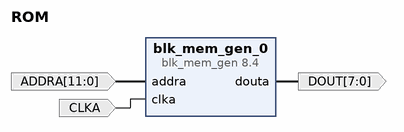
[diagram p0: block diagram of the top level]
# Vivado block design ROM, xc7z010clg400-1, Vivado 2022.2
create_bd_design ROM

create_bd_port -dir I CLKA
create_bd_port -dir O -from 7 -to 0 DOUT
create_bd_port -dir I -from 11 -to 0 ADDRA

create_bd_cell -type ip -vlnv xilinx.com:ip:blk_mem_gen:8.4 blk_mem_gen_0
set_property -dict [list \
  CONFIG.Coe_File ../../../../../../../Generador/sin.coe \
  CONFIG.Enable_A Always_Enabled \
  CONFIG.Fill_Remaining_Memory_Locations false \
  CONFIG.Load_Init_File true \
  CONFIG.Memory_Type Single_Port_ROM \
  CONFIG.Write_Depth_A 4096 \
  CONFIG.Write_Width_A 8 \
  CONFIG.use_bram_block Stand_Alone \
] [get_bd_cells blk_mem_gen_0]

# ---- connections ----

connect_bd_net [get_bd_ports ADDRA] [get_bd_pins blk_mem_gen_0/addra]
connect_bd_net [get_bd_ports CLKA] [get_bd_pins blk_mem_gen_0/clka]
connect_bd_net [get_bd_pins blk_mem_gen_0/douta] [get_bd_ports DOUT]

validate_bd_design
save_bd_design
